# Altium project First MGC3130 PCB.PrjPCB
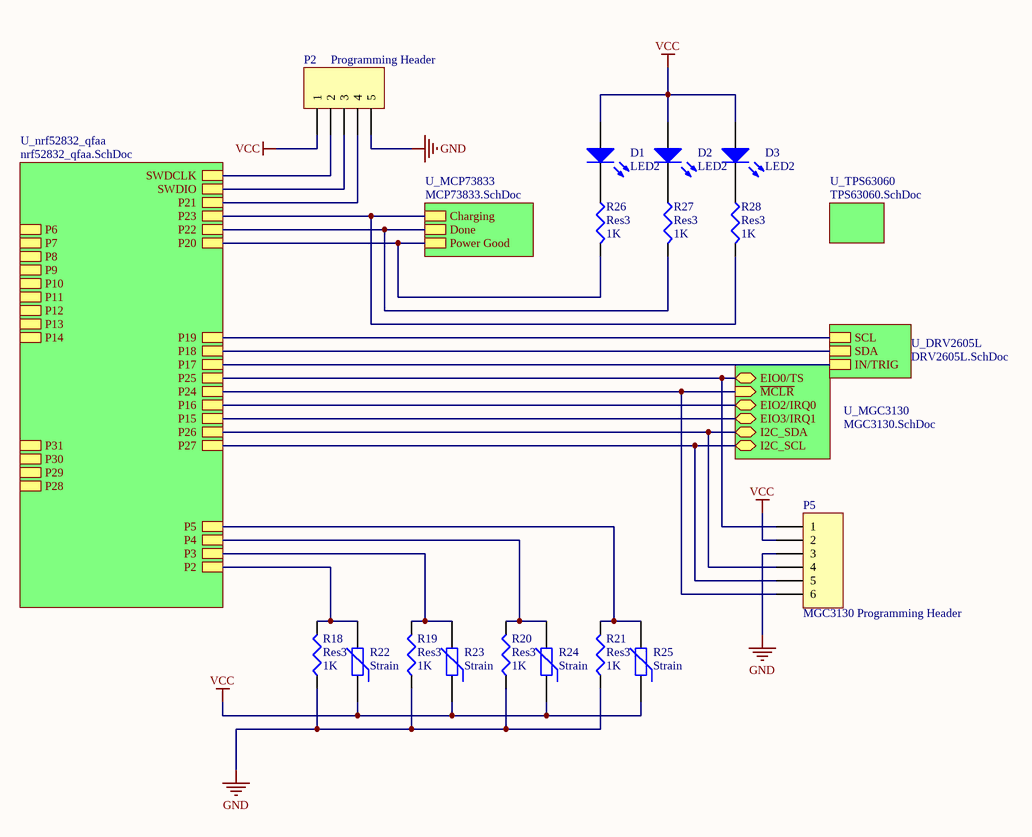
[diagram p0: Overview.SchDoc]
6 sheets, 84 parts. Net scope: hierarchical (ports join the sheet entries above them; power ports are global).
Board file: PCB V2.PcbDoc
Sheets:
  Overview.SchDoc
    U_MGC3130 = MGC3130.SchDoc
    U_DRV2605L = DRV2605L.SchDoc
    U_MCP73833 = MCP73833.SchDoc
    U_TPS63060 = TPS63060.SchDoc
    U_nrf52832_qfaa = nrf52832_qfaa.SchDoc

## Sheet Overview.SchDoc
size A4

### Parts
D1  LED2  [3.2X1.6X1.1]
D2  LED2  [3.2X1.6X1.1]
D3  LED2  [3.2X1.6X1.1]
P2  Programming Header  [HDR1X5]
P5  MGC3130 Programming Header  [HDR1X6]
R18  Res3  value 1K  [J1-0603]
R19  Res3  value 1K  [J1-0603]
R20  Res3  value 1K  [J1-0603]
R21  Res3  value 1K  [J1-0603]
R22  Strain  [6-0805_N]
R23  Strain  [6-0805_N]
R24  Strain  [6-0805_N]
R25  Strain  [6-0805_N]
R26  Res3  value 1K  [J1-0603]
R27  Res3  value 1K  [J1-0603]
R28  Res3  value 1K  [J1-0603]

### Sub-sheets
U_DRV2605L = DRV2605L.SchDoc: SCL, SDA, IN/TRIG
U_MCP73833 = MCP73833.SchDoc: Charging, Done, Power Good
U_MGC3130 = MGC3130.SchDoc: EIO0/TS (bidir), ~{MCLR} (in), EIO2/IRQ0 (bidir), EIO3/IRQ1 (bidir), I2C_SDA (bidir), I2C_SCL (bidir)
U_nrf52832_qfaa = nrf52832_qfaa.SchDoc: P2, P3, P4, P5, P6, P7, P8, P9, P10, P11, P12, P13, P14, P15, P16, P17, P18, P19, P20, P21, P31, P30, P29, P28, P27, P24, P23, P22, SWDIO, SWDCLK, P26, P25
U_TPS63060 = TPS63060.SchDoc: no entries

### Nets
GND: P2.5 P5.3 R18.1 R19.1 R20.1 R21.1
VCC: D1.1(A) D2.1(A) D3.1(A) P2.1 P5.2 R22.1 R23.1 R24.1 R25.1
P0.02/AIN0: R18.2 R22.2 ; sheet U_nrf52832_qfaa/P2
P0.03/AIN1: R19.2 R23.2 ; sheet U_nrf52832_qfaa/P3
P0.04/AIN2: R20.2 R24.2 ; sheet U_nrf52832_qfaa/P4
P0.05/AIN3: R21.2 R25.2 ; sheet U_nrf52832_qfaa/P5
P0.15: sheet U_MGC3130/EIO3/IRQ1, sheet U_nrf52832_qfaa/P15
P0.16: sheet U_MGC3130/EIO2/IRQ0, sheet U_nrf52832_qfaa/P16
P0.17: sheet U_DRV2605L/IN/TRIG, sheet U_nrf52832_qfaa/P17
P0.18: sheet U_DRV2605L/SDA, sheet U_nrf52832_qfaa/P18
P0.19: sheet U_DRV2605L/SCL, sheet U_nrf52832_qfaa/P19
P0.20: R26.2 ; sheet U_MCP73833/Power Good, sheet U_nrf52832_qfaa/P20
P0.21: P2.4 ; sheet U_nrf52832_qfaa/P21
P0.22: R27.2 ; sheet U_MCP73833/Done, sheet U_nrf52832_qfaa/P22
P0.23: R28.2 ; sheet U_MCP73833/Charging, sheet U_nrf52832_qfaa/P23
P0.24: P5.6 ; sheet U_MGC3130/~{MCLR}, sheet U_nrf52832_qfaa/P24
P0.25: P5.1 ; sheet U_MGC3130/EIO0/TS, sheet U_nrf52832_qfaa/P25
P0.26: P5.4 ; sheet U_MGC3130/I2C_SDA, sheet U_nrf52832_qfaa/P26
P0.27: P5.5 ; sheet U_MGC3130/I2C_SCL, sheet U_nrf52832_qfaa/P27
SWDCLK: P2.2 ; sheet U_nrf52832_qfaa/SWDCLK
SWDIO: P2.3 ; sheet U_nrf52832_qfaa/SWDIO
NetD1_2: D1.2(K) R26.1
NetD2_2: D2.2(K) R27.1
NetD3_2: D3.2(K) R28.1

### Library data of the parts
D1-D3 = LED2: Typical RED, GREEN, YELLOW, AMBER GaAs LED; Published: 8-Jun-2000; LatestRevisionDate: 17-Jul-2002; LatestRevisionNote: Re-released for DXP Platform.; PackageVersion: Feb-2002; PackageReference: 3.2X1.6X1.1; Publisher: Altium Limited; PackageDescription: SM LED; 2 Flat Leads
P2 = Header 5: Header, 5-Pin; LatestRevisionDate: 17-Jul-2002; LatestRevisionNote: Re-released for DXP Platform.; Publisher: Altium Limited
P5 = Header 6: Header, 6-Pin; LatestRevisionDate: 17-Jul-2002; LatestRevisionNote: Re-released for DXP Platform.; Publisher: Altium Limited
R18-R21 R26-R28 = Res3: Resistor; Published: 8-Jun-2000; LatestRevisionDate: 29-May-2009; LatestRevisionNote: IPC-7351 Footprint Added.; PackageReference: J1-0603; Publisher: Altium Limited; PackageDescription: Chip Resistor
R22-R25 = Res Varistor: Varistor (Voltage-Sensitive Resistor); Published: 24-Mar-1999; LatestRevisionDate: 29-May-2009; LatestRevisionNote: IPC-7351 Footprint Added.; PackageVersion: Mar-2003; PackageReference: 6-0805; Publisher: Altium Limited; PackageDescription: Chip Resistor 0805 Case Size; Code_IPC: RESC2012

## Sheet MGC3130.SchDoc
size A
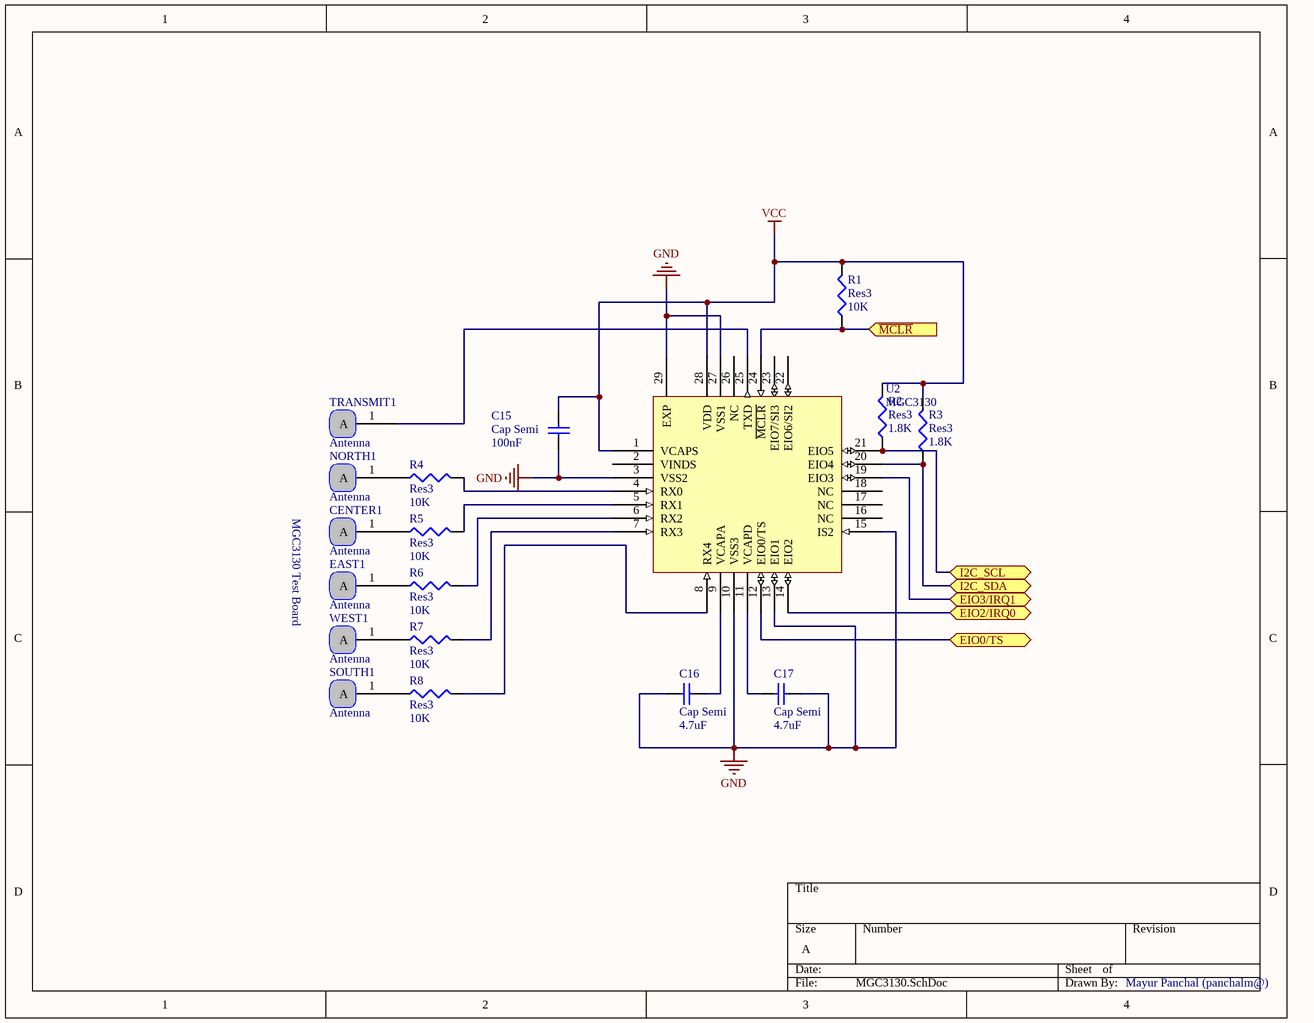
[diagram p1: MGC3130.SchDoc]

### Parts
C15  Cap Semi  value 100nF  [1608[0603]]
C16  Cap Semi  value 4.7uF  [1608[0603]]
C17  Cap Semi  value 4.7uF  [1608[0603]]
CENTER1  Antenna
EAST1  Antenna  [Vertical Electrode]
NORTH1  Antenna  [Horizontal Electrode]
R1  Res3  value 10K  [J1-0603]
R2  Res3  value 1.8K  [J1-0603]
R3  Res3  value 1.8K  [J1-0603]
R4  Res3  value 10K  [J1-0603]
R5  Res3  value 10K  [J1-0603]
R6  Res3  value 10K  [J1-0603]
R7  Res3  value 10K  [J1-0603]
R8  Res3  value 10K  [J1-0603]
SOUTH1  Antenna  [Horizontal Electrode]
TRANSMIT1  Antenna
U2  MGC3130  [QFN28]
WEST1  Antenna  [Vertical Electrode]

### Ports
EIO0/TS (bidir), EIO2/IRQ0 (bidir), EIO3/IRQ1 (bidir), I2C_SCL (bidir), I2C_SDA (bidir), ~{MCLR} (in)

### Nets
GND: C15.1 C16.1 C17.2 U2.3(VSS2) U2.10(VSS3) U2.13(EIO1) U2.15(IS2) U2.27(VSS1) U2.29(EXP)
VCC: C15.2 R1.2 R2.2 R3.2 U2.1(VCAPS) U2.28(VDD)
P0.15: U2.19(EIO3) ; port EIO3/IRQ1
P0.16: U2.14(EIO2) ; port EIO2/IRQ0
P0.24: R1.1 U2.24(~{MCLR}) ; port ~{MCLR}
P0.25: U2.12(EIO0/TS) ; port EIO0/TS
P0.26: R3.1 U2.20(EIO4) ; port I2C_SDA
P0.27: R2.1 U2.21(EIO5) ; port I2C_SCL
NetC16_2: C16.2 U2.9(VCAPA)
NetC17_1: C17.1 U2.11(VCAPD)
NetCENTER1_1: CENTER1.1(A) R5.1
NetEAST1_1: EAST1.1(A) R6.1
NetNORTH1_1: NORTH1.1(A) R4.1
NetR4_2: R4.2 U2.4(RX0)
NetR5_2: R5.2 U2.5(RX1)
NetR6_2: R6.2 U2.6(RX2)
NetR7_1: R7.1 WEST1.1(A)
NetR7_2: R7.2 U2.7(RX3)
NetR8_1: R8.1 SOUTH1.1(A)
NetR8_2: R8.2 U2.8(RX4)
NetTRANSMIT1_1: TRANSMIT1.1(A) U2.25(TXD)

Not connected (* = marked no-connect by the designer): U2 2(VINDS) 16(NC) 17(NC) 18(NC) 22(EIO6/SI2) 23(EIO7/SI3) 26(NC)

### Notes on the sheet
- MGC3130 Test Board
- Mayur Panchal (panchalm@)

### Library data of the parts
C15-C17 = Cap Semi: Capacitor (Semiconductor SIM Model); Published: 8-Jun-2000; LatestRevisionDate: 29-May-2009; LatestRevisionNote: IPC-7351 Footprint Added.; PackageReference: C1206; Publisher: Altium Limited; PackageDescription: Chip Capacitor
CENTER1 = Center Antenna
EAST1 = East Antenna
NORTH1 = North Antenna
R1-R8 = Res3: Resistor; Published: 8-Jun-2000; LatestRevisionDate: 29-May-2009; LatestRevisionNote: IPC-7351 Footprint Added.; PackageReference: J1-0603; Publisher: Altium Limited; PackageDescription: Chip Resistor
SOUTH1 = South Antenna
TRANSMIT1 = Transmit Antenna
U2 = MGC3130: Gesture Recognition IC
WEST1 = West Antenna

## Sheet DRV2605L.SchDoc
size A4
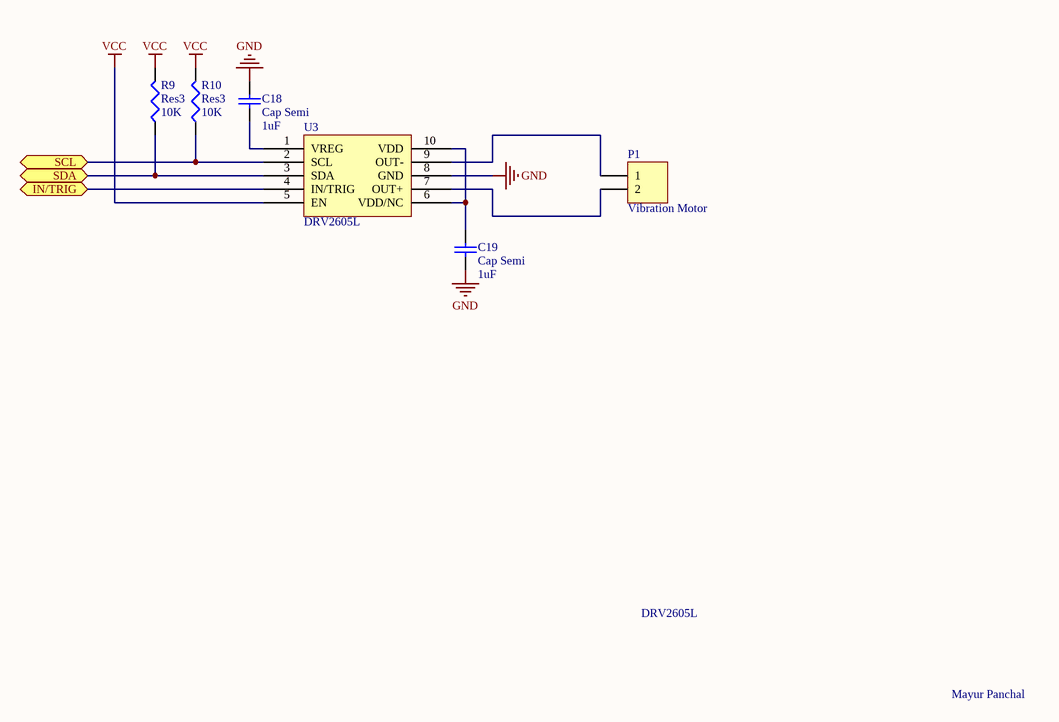
[diagram p2: DRV2605L.SchDoc]

### Parts
C18  Cap Semi  value 1uF  [1608[0603]]
C19  Cap Semi  value 1uF  [1608[0603]]
P1  Vibration Motor  [HDR1X2]
R9  Res3  value 10K  [J1-0603]
R10  Res3  value 10K  [J1-0603]
U3  DRV2605L  [DRV2605L]

### Ports
IN/TRIG, SCL, SDA

### Nets
GND: C18.2 C19.1 U3.8(GND)
VCC: R9.2 R10.2 U3.5(EN)
P0.17: U3.4(IN/TRIG) ; port IN/TRIG
P0.18: R9.1 U3.3(SDA) ; port SDA
P0.19: R10.1 U3.2(SCL) ; port SCL
NetC18_1: C18.1 U3.1(VREG)
NetC19_2: C19.2 U3.6(VDD/NC) U3.10(VDD)
NetP1_1: P1.1 U3.9(OUT-)
NetP1_2: P1.2 U3.7(OUT+)

### Notes on the sheet
- DRV2605L
- Mayur Panchal

### Library data of the parts
C18 C19 = Cap Semi: Capacitor (Semiconductor SIM Model); Published: 8-Jun-2000; LatestRevisionDate: 29-May-2009; LatestRevisionNote: IPC-7351 Footprint Added.; PackageReference: C1206; Publisher: Altium Limited; PackageDescription: Chip Capacitor
P1 = Header 2: Header, 2-Pin; LatestRevisionDate: 17-Jul-2002; LatestRevisionNote: Re-released for DXP Platform.; Publisher: Altium Limited
R9 R10 = Res3: Resistor; Published: 8-Jun-2000; LatestRevisionDate: 29-May-2009; LatestRevisionNote: IPC-7351 Footprint Added.; PackageReference: J1-0603; Publisher: Altium Limited; PackageDescription: Chip Resistor

## Sheet MCP73833.SchDoc
size A4
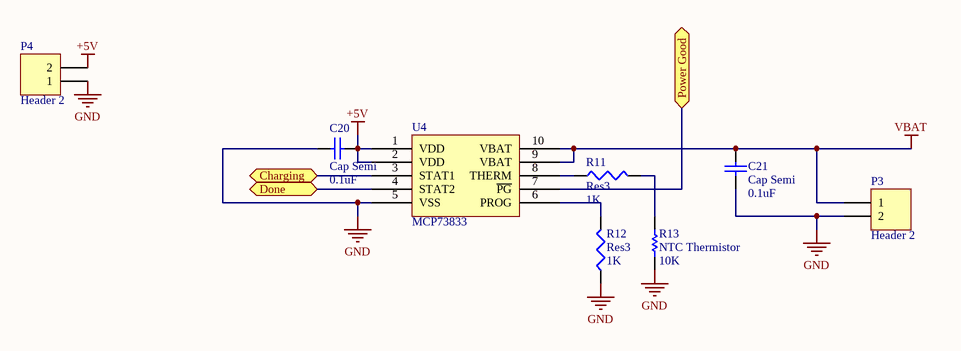
[diagram p3: MCP73833.SchDoc]

### Parts
C20  Cap Semi  value 0.1uF  [1608[0603]]
C21  Cap Semi  value 0.1uF  [1608[0603]]
P3  Header 2  [JST-PH-2]
P4  Header 2  [HDR1X2]
R11  Res3  value 1K  [J1-0603]
R12  Res3  value 1K  [J1-0603]
R13  NTC Thermistor  value 10K  [AXIAL-0.3]
U4  MCP73833  [TSSOP50P490X110-10N]

### Ports
Charging, Done, Power Good

### Nets
+5V: C20.1 P4.2 U4.1(VDD) U4.2(VDD)
GND: C20.2 C21.1 P3.2 P4.1 R12.1 R13.1 U4.5(VSS)
VBAT: C21.2 P3.1 U4.9(VBAT) U4.10(VBAT)
P0.20: U4.7(~{PG}) ; port Power Good
P0.22: U4.4(STAT2) ; port Done
P0.23: U4.3(STAT1) ; port Charging
NetR11_1: R11.1 U4.8(THERM)
NetR11_2: R11.2 R13.2
NetR12_2: R12.2 U4.6(PROG)

### Library data of the parts
C20 C21 = Cap Semi: Capacitor (Semiconductor SIM Model); Published: 8-Jun-2000; LatestRevisionDate: 29-May-2009; LatestRevisionNote: IPC-7351 Footprint Added.; PackageReference: C1206; Publisher: Altium Limited; PackageDescription: Chip Capacitor
P3 P4 = Header 2: Header, 2-Pin; LatestRevisionDate: 17-Jul-2002; LatestRevisionNote: Re-released for DXP Platform.; Publisher: Altium Limited
R11 R12 = Res3: Resistor; Published: 8-Jun-2000; LatestRevisionDate: 29-May-2009; LatestRevisionNote: IPC-7351 Footprint Added.; PackageReference: J1-0603; Publisher: Altium Limited; PackageDescription: Chip Resistor
R13 = Res1: Resistor; Published: 8-Jun-2000; LatestRevisionDate: 17-Jul-2002; LatestRevisionNote: Re-released for DXP Platform.; PackageReference: AXIAL-0.3; Publisher: Altium Limited; PackageDescription: Axial Device, Thru-Hole; 2 Leads; 0.3 in Pin Spacing

## Sheet TPS63060.SchDoc
size A4
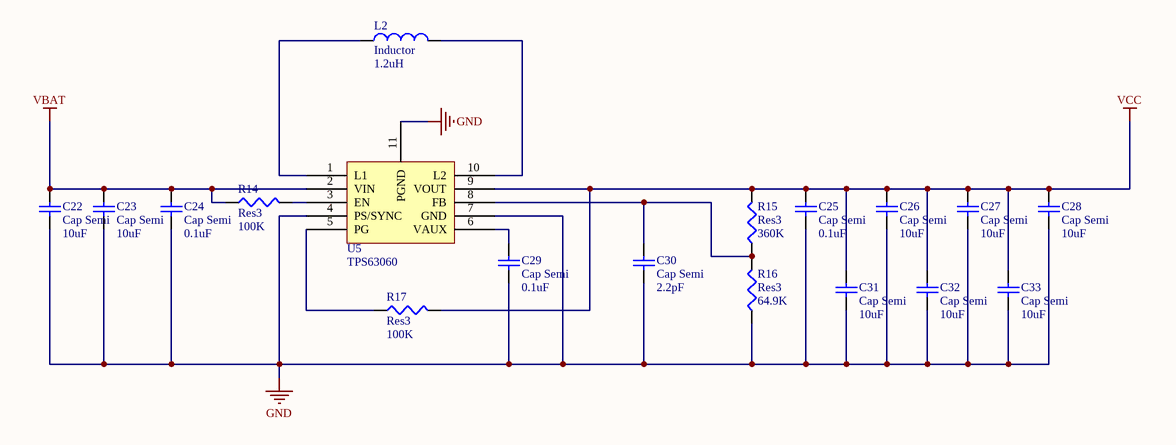
[diagram p4: TPS63060.SchDoc]

### Parts
C22  Cap Semi  value 10uF  [1608[0603]]
C23  Cap Semi  value 10uF  [1608[0603]]
C24  Cap Semi  value 0.1uF  [1608[0603]]
C25  Cap Semi  value 0.1uF  [1608[0603]]
C26  Cap Semi  value 10uF  [1608[0603]]
C27  Cap Semi  value 10uF  [1608[0603]]
C28  Cap Semi  value 10uF  [1608[0603]]
C29  Cap Semi  value 0.1uF  [1608[0603]]
C30  Cap Semi  value 2.2pF  [1608[0603]]
C31  Cap Semi  value 10uF  [1608[0603]]
C32  Cap Semi  value 10uF  [1608[0603]]
C33  Cap Semi  value 10uF  [1608[0603]]
L2  Inductor  value 1.2uH  [INDC4532]
R14  Res3  value 100K  [J1-0603]
R15  Res3  value 360K  [J1-0603]
R16  Res3  value 64.9K  [J1-0603]
R17  Res3  value 100K  [J1-0603]
U5  TPS63060  [S-PSWON-N10]

### Nets
GND: C22.1 C23.1 C24.1 C25.1 C26.1 C27.1 C28.1 C29.1 C30.1 C31.1 C32.1 C33.1 R16.1 U5.4(PS/SYNC) U5.7(GND) U5.11(PGND)
VBAT: C22.2 C23.2 C24.2 R14.1 U5.2(VIN)
VCC: C25.2 C26.2 C27.2 C28.2 C31.2 C32.2 C33.2 R15.2 R17.2 U5.9(VOUT)
NetC29_2: C29.2 U5.6(VAUX)
NetC30_2: C30.2 R15.1 R16.2 U5.8(FB)
NetL2_1: L2.1 U5.1(L1)
NetL2_2: L2.2 U5.10(L2)
NetR14_2: R14.2 U5.3(EN)
NetR17_1: R17.1 U5.5(PG)

### Library data of the parts
C22-C33 = Cap Semi: Capacitor (Semiconductor SIM Model); Published: 8-Jun-2000; LatestRevisionDate: 29-May-2009; LatestRevisionNote: IPC-7351 Footprint Added.; PackageReference: C1206; Publisher: Altium Limited; PackageDescription: Chip Capacitor
L2 = Inductor: Code_IEC: 1005; Published: 8-Jun-2000; LatestRevisionDate: 29-May-2009; LatestRevisionNote: IPC-7351 Footprint Added.; PackageReference: 0402-A; Publisher: Altium Limited; PackageDescription: Chip Inductor; Code_JEITA: 0402
R14-R17 = Res3: Resistor; Published: 8-Jun-2000; LatestRevisionDate: 29-May-2009; LatestRevisionNote: IPC-7351 Footprint Added.; PackageReference: J1-0603; Publisher: Altium Limited; PackageDescription: Chip Resistor

## Sheet nrf52832_qfaa.SchDoc: nRF52832-QFAA Reference Layout
size A4; Revision: 1.1; SheetNumber: 1; SheetTotal: 1; DrawnBy: RUBR/KJP; DocumentSize: A4; PCAName: nRF52832-QFAA Reference Layout
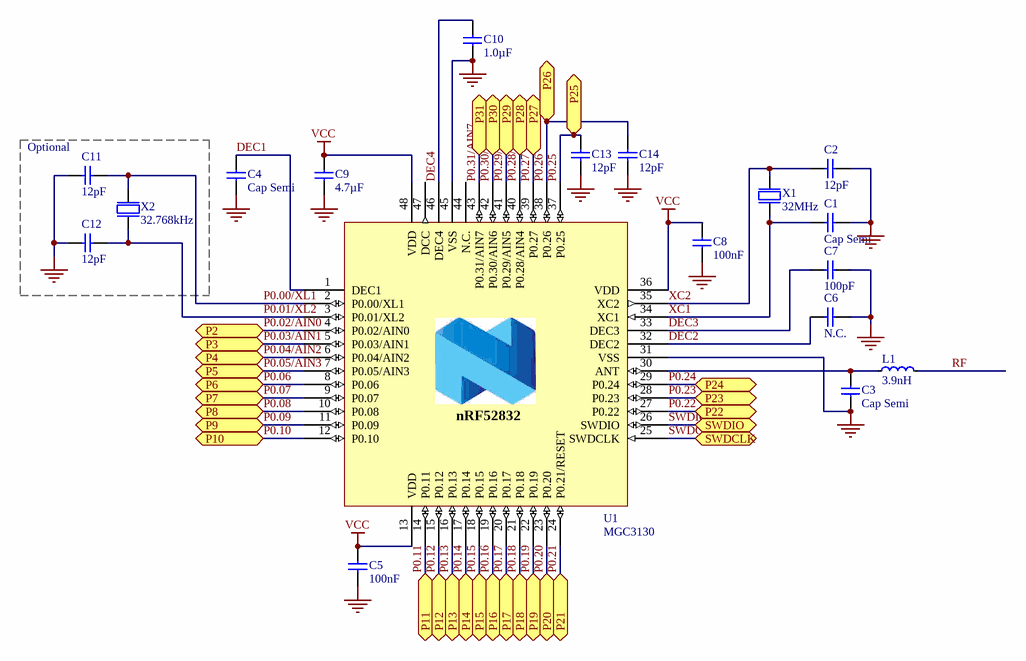
[diagram p5: nrf52832_qfaa.SchDoc]

### Parts
C1  Cap Semi  [CAPC1005X04L]
C2  12pF  [CAPC1005X04L]
C3  Cap Semi  [CAPC1005X04L]
C4  Cap Semi  [INDC1005X04L]
C5  100nF  [CAPC1005X04L]
C6  N.C.  [CAPC1005X04L]
C7  100pF  [CAPC1005X04L]
C8  100nF  [CAPC1005X04L]
C9  4.7µF  [CAPC1608X06L]
C10  1.0µF  [CAPC1608X06L]
C11  12pF  [CAPC1005X04L]
C12  12pF  [CAPC1005X04L]
C13  12pF  [CAPC1005X04L]
C14  12pF  [CAPC1005X04L]
L1  3.9nH  [INDC1005X04L]
U1  MGC3130  [QFN40P600X600X90-48N]
X1  32MHz  [BT-XTAL_2016]
X2  32.768kHz  [XTAL_3215]

### Blocks framed on the sheet
Optional: C11 C12 X2

### Ports
P2, P3, P4, P5, P6, P7, P8, P9, P10, P11, P12, P13, P14, P15, P16, P17, P18, P19, P20, P21, P22, P23, P24, P25, P26, P27, P28, P29, P30, P31, SWDCLK, SWDIO

### Nets
GND: C1.2 C2.2 C3.1 C4.2 C5.2 C6.1 C7.2 C8.2 C9.2 C10.1 C11.2 C12.2 C13.2 C14.2 U1.31(VSS) U1.45(VSS) U1.49(GND) X1.2(GND) X1.4(GND)
VCC: C5.1 C8.1 C9.1 U1.13(VDD) U1.36(VDD) U1.48(VDD)
DEC1: C4.1 U1.1(DEC1)
DEC2: C6.2 U1.32(DEC2)
DEC3: C7.1 U1.33(DEC3)
DEC4: C10.2 U1.46(DEC4)
P0.00/XL1: C11.1 U1.2(P0.00/XL1) X2.1(inp)
P0.01/XL2: C12.1 U1.3(P0.01/XL2) X2.2(out)
P0.02/AIN0: U1.4(P0.02/AIN0) ; port P2
P0.03/AIN1: U1.5(P0.03/AIN1) ; port P3
P0.04/AIN2: U1.6(P0.04/AIN2) ; port P4
P0.05/AIN3: U1.7(P0.05/AIN3) ; port P5
P0.06: U1.8(P0.06) ; port P6
P0.07: U1.9(P0.07) ; port P7
P0.08: U1.10(P0.08) ; port P8
P0.09: U1.11(P0.09) ; port P9
P0.10: U1.12(P0.10) ; port P10
P0.11: U1.14(P0.11) ; port P11
P0.12: U1.15(P0.12) ; port P12
P0.13: U1.16(P0.13) ; port P13
P0.14: U1.17(P0.14) ; port P14
P0.15: U1.18(P0.15) ; port P15
P0.16: U1.19(P0.16) ; port P16
P0.17: U1.20(P0.17) ; port P17
P0.18: U1.21(P0.18) ; port P18
P0.19: U1.22(P0.19) ; port P19
P0.20: U1.23(P0.20) ; port P20
P0.21: U1.24(P0.21/RESET) ; port P21
P0.22: U1.27(P0.22) ; port P22
P0.23: U1.28(P0.23) ; port P23
P0.24: U1.29(P0.24) ; port P24
P0.25: C13.1 U1.37(P0.25) ; port P25
P0.26: C14.1 U1.38(P0.26) ; port P26
P0.27: U1.39(P0.27) ; port P27
P0.28/AIN4: U1.40(P0.28/AIN4) ; port P28
P0.29/AIN5: U1.41(P0.29/AIN5) ; port P29
P0.30/AIN6: U1.42(P0.30/AIN6) ; port P30
P0.31/AIN7: U1.43(P0.31/AIN7) ; port P31
RF: L1.2
SWDCLK: U1.25(SWDCLK) ; port SWDCLK
SWDIO: U1.26(SWDIO) ; port SWDIO
XC1: C1.1 U1.34(XC1) X1.1(inp)
XC2: C2.1 U1.35(XC2) X1.3(out)
NetC3_2: C3.2 L1.1 U1.30(ANT)

Not connected (* = marked no-connect by the designer): U1 44(N.C.) 47(DCC)

### Notes on the sheet
- Title
- Size
- Date:
- Project Number
- Sheet         of
- Revision
- File:
- Drawn By:
- (in symbol nRF52832-QFAA) nRF52832

### Library data of the parts
C1 = C0402-12p: Capacitor, NP0, ±2%; Value: 12pF; Note: 50V; Artikkelnr Noca: 20029159; Artikkelnr Simpro: N.A.; Part Number: C0402-12p; Manufacturer: *; Manufacturer Part Number: *; Datasheet: *; LatestRevisionDate: 2011-05-11; Pin Count: 2; Publisher: Nordic Semiconductor; Published: 2009-05-08; Supplier: *; Supplier part number: *; 2nd source Supplier: *; 2nd source part number: *; Footprint Doc: 0402
C2 C11-C14 = C0402-12p: Capacitor, NP0, ±2%; Note: 50V; Artikkelnr Noca: 20029159; Artikkelnr Simpro: N.A.; Part Number: C0402-12p; Manufacturer: *; Manufacturer Part Number: *; Datasheet: *; LatestRevisionDate: 2011-05-11; Pin Count: 2; Publisher: Nordic Semiconductor; Published: 2009-05-08; Value: 12pF; Supplier: *; Supplier part number: *; 2nd source Supplier: *; 2nd source part number: *; Footprint Doc: 0402
C3 = C0402-0.8p: Capacitor, NP0, ±5%; Value: 0.8pF; Note: 50V; Artikkelnr Noca: 20029147; Artikkelnr Simpro: N.A.; Part Number: C0402-0.8p; Manufacturer: *; Manufacturer Part Number: *; Datasheet: *; LatestRevisionDate: 2012-11-21; Pin Count: 2; Publisher: Nordic Semiconductor; Published: 2009-05-08; Supplier: *; Supplier part number: *; 2nd source Supplier: *; 2nd source part number: *; Footprint Doc: 0402
C4 = C0402-100n: Capacitor, X7R, ±10%; Value: 100nF; Note: 16V; Artikkelnr Noca: 20039200; Artikkelnr Simpro: N.A.; Part Number: C0402-100n; Manufacturer: *; Manufacturer Part Number: *; Datasheet: *; LatestRevisionDate: 2009-11-23; Pin Count: 2; Publisher: Nordic Semiconductor; Published: 2009-05-08; Supplier: *; Supplier part number: *; 2nd source Supplier: *; 2nd source part number: *; Footprint Doc: 0402
C5 C8 = C0402-100n: Capacitor, X7R, ±10%; Note: 16V; Artikkelnr Noca: 20039200; Artikkelnr Simpro: N.A.; Part Number: C0402-100n; Manufacturer: *; Manufacturer Part Number: *; Datasheet: *; LatestRevisionDate: 2009-11-23; Pin Count: 2; Publisher: Nordic Semiconductor; Published: 2009-05-08; Value: 100nF; Supplier: *; Supplier part number: *; 2nd source Supplier: *; 2nd source part number: *; Footprint Doc: 0402
C6 = C0402-N.C.: Not mounted; Note: Chip Cap; Artikkelnr Noca: N.A.; Part Number: C0402-N.C.; Manufacturer: *; Manufacturer Part Number: *; Datasheet: *; LatestRevisionDate: 2009-05-08; Pin Count: 2; Publisher: Nordic Semiconductor; Published: 2009-05-08; Value: N.C.; Supplier: *; Supplier part number: *; 2nd source Supplier: *; 2nd source part number: *; Footprint Doc: 0402; Artikkelnr Simpro: N.A.
C7 = C0402-100p: Capacitor, NP0, ±5%; Note: 50V; Artikkelnr Noca: 20029135; Artikkelnr Simpro: N.A.; Part Number: C0402-100p; Manufacturer: *; Manufacturer Part Number: *; Datasheet: *; LatestRevisionDate: 2009-05-08; Pin Count: 2; Publisher: Nordic Semiconductor; Published: 2009-05-08; Value: 100pF; Supplier: *; Supplier part number: *; 2nd source Supplier: *; 2nd source part number: *; Footprint Doc: 0402
C9 = C0603-4µ7: Capacitor, X5R, ±10%; Note: 6.3V; Artikkelnr Noca: 20069060; Artikkelnr Simpro: N.A.; Part Number: C0603-4µ7; Manufacturer: *; Manufacturer Part Number: *; Datasheet: *; LatestRevisionDate: 2009-11-23; Pin Count: 2; Publisher: Nordic Semiconductor; Published: 2009-05-08; Value: 4.7µF; Supplier: *; Supplier part number: *; 2nd source Supplier: *; 2nd source part number: *; Footprint Doc: 0603
C10 = C0603-1µ0: Capacitor, X7R, ±10%; Note: 16V; Artikkelnr Noca: 20039335; Artikkelnr Simpro: N.A.; Part Number: C0603-1µ0; Manufacturer: *; Manufacturer Part Number: *; Datasheet: *; LatestRevisionDate: 2013-06-05; Pin Count: 2; Publisher: Nordic Semiconductor; Published: 2009-05-08; Value: 1.0µF; Supplier: *; Supplier part number: *; 2nd source Supplier: *; 2nd source part number: *; Footprint Doc: 0603
L1 = L0402-3n9: High frequency chip inductor ±5%; Manufacturer: Murata; Manufacturer Part Number: LQP15MN3N9B02D; Artikkelnr Noca: 33029151; Artikkelnr Simpro: N.A.; Part Number: L0402-3n9; Datasheet: http://search.murata.co.jp/Ceramy/image/img/PDF/ENG/L0075S0084LQP15M.pdf; LatestRevisionDate: 2012-09-19; Pin Count: 2; Publisher: Nordic Semiconductor; Published: 2009-05-08; Value: 3.9nH; Note: High frequency chip inductor ±5%; Supplier: Digi-Key; Supplier part number: 490-1131-1-ND; 2nd source Supplier: *; 2nd source part number: *; Footprint Doc: 0402
U1 = nRF52832-QFAA: Multi-protocol Bluetooth Low Energy, ANT and 2.4GHz proprietary system-on-chip; Manufacturer: Nordic Semiconductor; Artikkelnr Noca: N.A.; Part Number: nRF52832-QFAA; Manufacturer Part Number: nRF52832-QFAA; Datasheet: *; LatestRevisionDate: 2014-11-26; Pin Count: 48; Publisher: Nordic Semiconductor; Published: 2014-11-26; Value: nRF52832-QFAA; Note: *; Supplier: Nordic Semiconductor; Supplier part number: *; 2nd source Supplier: *; 2nd source part number: *; Footprint Doc: QFN-48; Artikkelnr Simpro: N.A.
X1 = XTAL_SMD2016_32MHz_8pF_General: XTAL SMD 2016, 32MHz, Cl=8pF, Total Tol: ±40ppm; Note: XTAL SMD 32.000MHz; Artikkelnr Noca: N.A.; Part Number: XTAL_SMD2016_32MHz_8pF_General; Manufacturer: *; Manufacturer Part Number: *; Datasheet: *; LatestRevisionDate: 2016-08-19; Pin Count: 4; Publisher: Nordic Semiconductor; Published: 2016-08-19; Value: 32MHz; Supplier: *; Supplier part number: *; 2nd source Supplier: *; 2nd source part number: *; Footprint Doc: XTAL_2016; Artikkelnr Simpro: N.A.
X2 = XTAL_SMD3215_32.768kHz_9pF_General: XTAL SMD 3215, 32.768kHz, Cl=9pF, Total Tol: ±50ppm; Note: XTAL SMD 32.768kHz; Artikkelnr Noca: N.A.; Part Number: XTAL_SMD3215_32.768kHz_9pF_General; Manufacturer: *; Manufacturer Part Number: *; Datasheet: *; LatestRevisionDate: 2016-08-19; Pin Count: 2; Publisher: Nordic Semiconductor; Published: 2016-08-19; Value: 32.768kHz; Supplier: *; Supplier part number: *; 2nd source Supplier: *; 2nd source part number: *; Footprint Doc: XTAL_3215; Artikkelnr Simpro: N.A.

## Nets that join several sheets
GND: Overview (6 pins), MGC3130 (9 pins), DRV2605L (C18.2 C19.1 U3.8), MCP73833 (7 pins), TPS63060 (16 pins), nrf52832_qfaa (19 pins)
VBAT: MCP73833 (C21.2 P3.1 U4.9 U4.10), TPS63060 (5 pins)
VCC: Overview (9 pins), MGC3130 (6 pins), DRV2605L (R9.2 R10.2 U3.5), TPS63060 (10 pins), nrf52832_qfaa (6 pins)
P0.02/AIN0: Overview (R18.2 R22.2), nrf52832_qfaa (U1.4)
P0.03/AIN1: Overview (R19.2 R23.2), nrf52832_qfaa (U1.5)
P0.04/AIN2: Overview (R20.2 R24.2), nrf52832_qfaa (U1.6)
P0.05/AIN3: Overview (R21.2 R25.2), nrf52832_qfaa (U1.7)
P0.15: MGC3130 (U2.19), nrf52832_qfaa (U1.18)
P0.16: MGC3130 (U2.14), nrf52832_qfaa (U1.19)
P0.17: DRV2605L (U3.4), nrf52832_qfaa (U1.20)
P0.18: DRV2605L (R9.1 U3.3), nrf52832_qfaa (U1.21)
P0.19: DRV2605L (R10.1 U3.2), nrf52832_qfaa (U1.22)
P0.20: Overview (R26.2), MCP73833 (U4.7), nrf52832_qfaa (U1.23)
P0.21: Overview (P2.4), nrf52832_qfaa (U1.24)
P0.22: Overview (R27.2), MCP73833 (U4.4), nrf52832_qfaa (U1.27)
P0.23: Overview (R28.2), MCP73833 (U4.3), nrf52832_qfaa (U1.28)
P0.24: Overview (P5.6), MGC3130 (R1.1 U2.24), nrf52832_qfaa (U1.29)
P0.25: Overview (P5.1), MGC3130 (U2.12), nrf52832_qfaa (C13.1 U1.37)
P0.26: Overview (P5.4), MGC3130 (R3.1 U2.20), nrf52832_qfaa (C14.1 U1.38)
P0.27: Overview (P5.5), MGC3130 (R2.1 U2.21), nrf52832_qfaa (U1.39)
SWDCLK: Overview (P2.2), nrf52832_qfaa (U1.25)
SWDIO: Overview (P2.3), nrf52832_qfaa (U1.26)